# Altium schematic sheet BlinkLight.SchDoc
size B
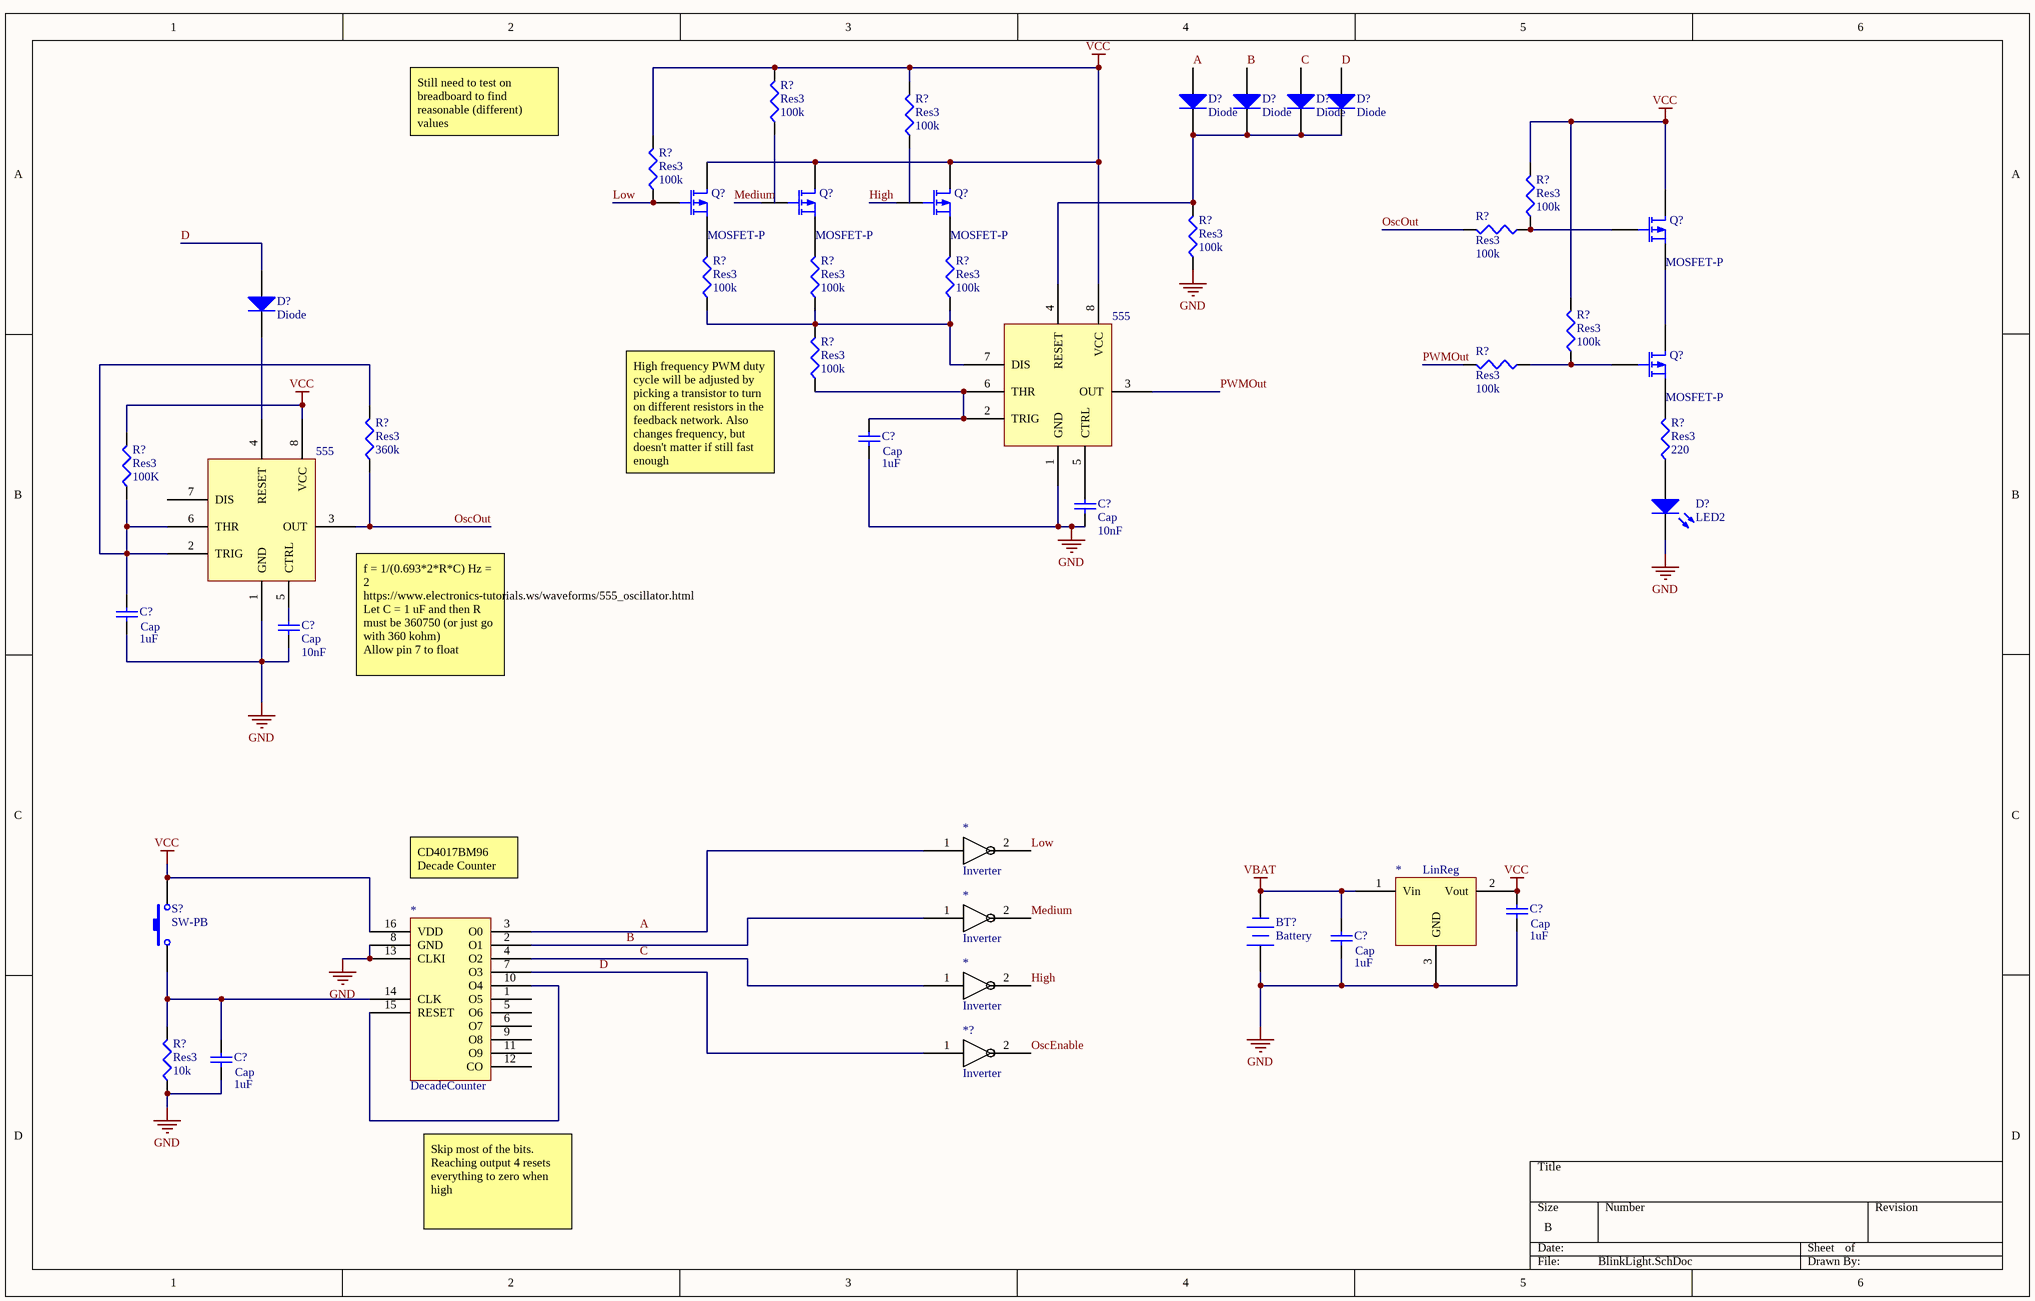
[diagram p0: BlinkLight.SchDoc]

## Parts
(Parts that share a designator on the sheet are numbered #1, #2 ... from top to bottom, then left to right.)
*#1  Inverter
*#2  Inverter
*#3  LinReg
*#4  Inverter
*#5  DecadeCounter
*?  Inverter
?#1  555
?#2  555
BT?  Battery  [BAT-2]
C?#1  Cap  value 1uF  [RAD-0.3]
C?#2  Cap  value 10nF  [RAD-0.3]
C?#3  Cap  value 1uF  [RAD-0.3]
C?#4  Cap  value 10nF  [RAD-0.3]
C?#5  Cap  value 1uF  [RAD-0.3]
C?#6  Cap  value 1uF  [RAD-0.3]
C?#7  Cap  value 1uF  [RAD-0.3]
D?#1  Diode  [SMC]
D?#2  Diode  [SMC]
D?#3  Diode  [SMC]
D?#4  Diode  [SMC]
D?#5  Diode  [SMC]
D?#6  LED2  [3.2X1.6X1.1]
Q?#1  MOSFET-P  [E3]
Q?#2  MOSFET-P  [E3]
Q?#3  MOSFET-P  [E3]
Q?#4  MOSFET-P  [E3]
Q?#5  MOSFET-P  [E3]
R?#1  Res3  value 100k  [J1-0603]
R?#2  Res3  value 100k  [J1-0603]
R?#3  Res3  value 100k  [J1-0603]
R?#4  Res3  value 100k  [J1-0603]
R?#5  Res3  value 100k  [J1-0603]
R?#6  Res3  value 100k  [J1-0603]
R?#7  Res3  value 100k  [J1-0603]
R?#8  Res3  value 100k  [J1-0603]
R?#9  Res3  value 100k  [J1-0603]
R?#10  Res3  value 100k  [J1-0603]
R?#11  Res3  value 100k  [J1-0603]
R?#12  Res3  value 100k  [J1-0603]
R?#13  Res3  value 360k  [J1-0603]
R?#14  Res3  value 220  [J1-0603]
R?#15  Res3  value 100K  [J1-0603]
R?#16  Res3  value 10k  [J1-0603]
S?  SW-PB  [SPST-2]

## Nets
GND: *#3.3(GND) *#5.8(GND) *#5.13(CLKI) ?#1.1(GND) ?#2.1(GND) BT?.1(+) C?#1.1 C?#2.1 C?#3.1 C?#4.1 C?#5.1 C?#6.1 C?#7.1 D?#6.2(K) R?#6.1 R?#16.1
VBAT: *#3.1(Vin) BT?.2(-) C?#6.2
VCC: *#3.2(Vout) *#5.16(VDD) ?#1.8(VCC) ?#2.8(VCC) C?#5.2 Q?#1.1(D) Q?#2.1(D) Q?#3.1(D) Q?#4.1(D) R?#1.2 R?#2.2 R?#3.2 R?#4.2 R?#10.2 R?#15.2 S?.2
A: *#1.1 *#5.3(O0) D?#1.1(A)
B: *#2.1 *#5.2(O1) D?#2.1(A)
C: *#4.1 *#5.4(O2) D?#3.1(A)
D: *#5.7(O3) *?.1 D?#4.1(A) D?#5.1(A)
High: *#4.2 Q?#3.2(G)
Low: *#1.2 Q?#1.2(G) R?#3.1
Medium: *#2.2 Q?#2.2(G)
OscEnable: *?.2
OscOut: ?#2.3(OUT) R?#5.2 R?#13.1
PWMOut: ?#1.3(OUT) R?#12.2
Net*#5_10: *#5.10(O4) *#5.15(RESET)
Net*#5_14: *#5.14(CLK) C?#7.2 R?#16.2 S?.1
Net?#1_2: ?#1.2(TRIG) ?#1.6(THR) C?#1.2 R?#11.1
Net?#1_4: ?#1.4(RESET) D?#1.2(K) D?#2.2(K) D?#3.2(K) D?#4.2(K) R?#6.2
Net?#1_5: ?#1.5(CTRL) C?#2.2
Net?#1_7: ?#1.7(DIS) R?#7.1 R?#8.1 R?#9.1 R?#11.2
Net?#2_2: ?#2.2(TRIG) ?#2.6(THR) C?#3.2 R?#13.2 R?#15.1
Net?#2_4: ?#2.4(RESET) D?#5.2(K)
Net?#2_5: ?#2.5(CTRL) C?#4.2
NetD?#6_1: D?#6.1(A) R?#14.1
NetQ?#1_3: Q?#1.3(S) R?#7.2
NetQ?#2_3: Q?#2.3(S) R?#8.2
NetQ?#3_3: Q?#3.3(S) R?#9.2
NetQ?#4_2: Q?#4.2(G) R?#4.1 R?#5.1
NetQ?#4_3: Q?#4.3(S) Q?#5.1(D)
NetQ?#5_2: Q?#5.2(G) R?#10.1 R?#12.1
NetQ?#5_3: Q?#5.3(S) R?#14.2

Not connected (* = marked no-connect by the designer): *#5 1(O5) 5(O6) 6(O7) 9(O8) 11(O9) 12(CO); ?#2 7(DIS); R?#1 1; R?#2 1

## Notes on the sheet
- Still need to test on breadboard to find reasonable (different) values
- (near R?#11) High frequency PWM duty cycle will be adjusted by picking a transistor to turn on different resistors in the feedback network. Also changes frequency, but doesn't matter if still fast enough
- f = 1/(0.693*2*R*C) Hz = 2
  https://www.electronics-tutorials.ws/waveforms/555_oscillator.html
  Let C = 1 uF and then R must be 360750 (or just go with 360 kohm)
  Allow pin 7 to float
- CD4017BM96 Decade Counter
- Skip most of the bits. Reaching output 4 resets everything to zero when high

## Library data of the parts
BT? = Battery: Multicell Battery; Published: 24-Mar-1999; LatestRevisionDate: 17-Jul-2002; LatestRevisionNote: Re-released for DXP Platform.; PackageReference: BAT-2; Publisher: Altium Limited; PackageDescription: Battery; 2 Leads
C?#1-C?#7 = Cap: Capacitor; Published: 8-Jun-2000; LatestRevisionDate: 17-Jul-2002; LatestRevisionNote: Re-released for DXP Platform.; PackageReference: RAD-0.3; Publisher: Altium Limited; PackageDescription: Radial Cap, Thru-Hole; 2 Leads; 0.3 in Pin Spacing
D?#1-D?#5 = Diode: Default Diode; Published: 8-Jun-2000; LatestRevisionDate: 17-Jul-2002; LatestRevisionNote: Re-released for DXP Platform.; PackageVersion: Sep-1996; PackageReference: SMC; Publisher: Altium Limited; PackageDescription: DO-214-AB/SMC; 2 C-Bend Leads; Body 7.9 x 5.9 mm, inc. leads (LxW); Code_JEDEC: DO-214-AB
D?#6 = LED2: Typical RED, GREEN, YELLOW, AMBER GaAs LED; Published: 8-Jun-2000; LatestRevisionDate: 17-Jul-2002; LatestRevisionNote: Re-released for DXP Platform.; PackageVersion: Feb-2002; PackageReference: 3.2X1.6X1.1; Publisher: Altium Limited; PackageDescription: SM LED; 2 Flat Leads
Q?#1-Q?#5 = MOSFET-P: P-Channel MOSFET; Published: 8-Jun-2000; LatestRevisionDate: 17-Jul-2002; LatestRevisionNote: Re-released for DXP Platform.; PackageVersion: 1995/1996; PackageReference: E3; Publisher: Altium Limited; PackageDescription: TO, Flat Index; 3 In-Line, Axial Leads; Body Dia. 4.6mm; Lead Dia. 0.5 mm (max)
R?#1-R?#16 = Res3: Resistor; Published: 8-Jun-2000; LatestRevisionDate: 29-May-2009; LatestRevisionNote: IPC-7351 Footprint Added.; PackageReference: J1-0603; Publisher: Altium Limited; PackageDescription: Chip Resistor
S? = SW-PB: Switch; Published: 24-Mar-1999; LatestRevisionDate: 17-Jul-2002; LatestRevisionNote: Re-released for DXP Platform.; PackageReference: SPST-2; Publisher: Altium Limited; PackageDescription: Switch; 2 Leads